# EAGLE design fixture (EAGLE 6.5.0)
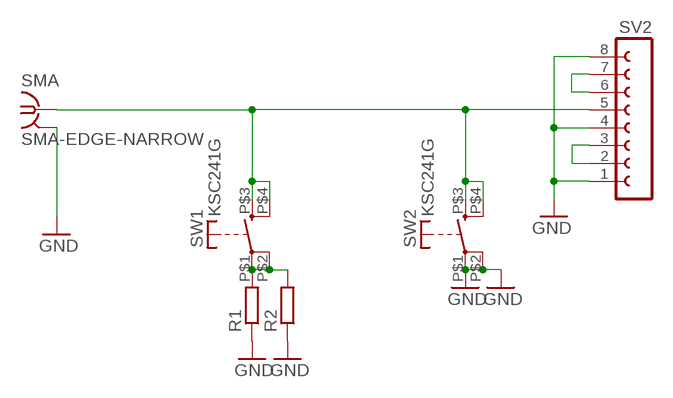
[diagram p0: schematic, sheet 1]

## Parts
R1  R-EU_M0805  [M0805]
R2  R-EU_M0805  [M0805]
SMA  SMA-EDGE-NARROW  [SMD-EDGE-NARROW]
SV2  FE08-1  [FE08]
SW1  KSC241G  [KSC241G]
SW2  KSC241G  [KSC241G]

## Nets
GND: R1.1 R2.1 SMA.G@1 SMA.G@2 SMA.G@3 SMA.G@4 SV2.1 SV2.4 SV2.8 SW2.P$1(P) SW2.P$2(P)
N$2: SV2.2 SV2.3
N$3: R1.2 R2.2 SW1.P$1(P) SW1.P$2(P)
N$4: SV2.6 SV2.7
SIG: SMA.1 SV2.5 SW1.P$3(S) SW1.P$4(S) SW2.P$3(S) SW2.P$4(S)

## Library data of the parts
R1 R2 = resistor:R-EU_: RESISTOR, European symbol
SMA = con-coax:SMA-EDGE-NARROW: Narrow SMA edge connector.
SV2 = con-lsta:FE08-1: FEMALE HEADER; OC_FARNELL: unknown; OC_NEWARK: unknown
SW1 SW2 = switch-misc:KSC241G

## Board
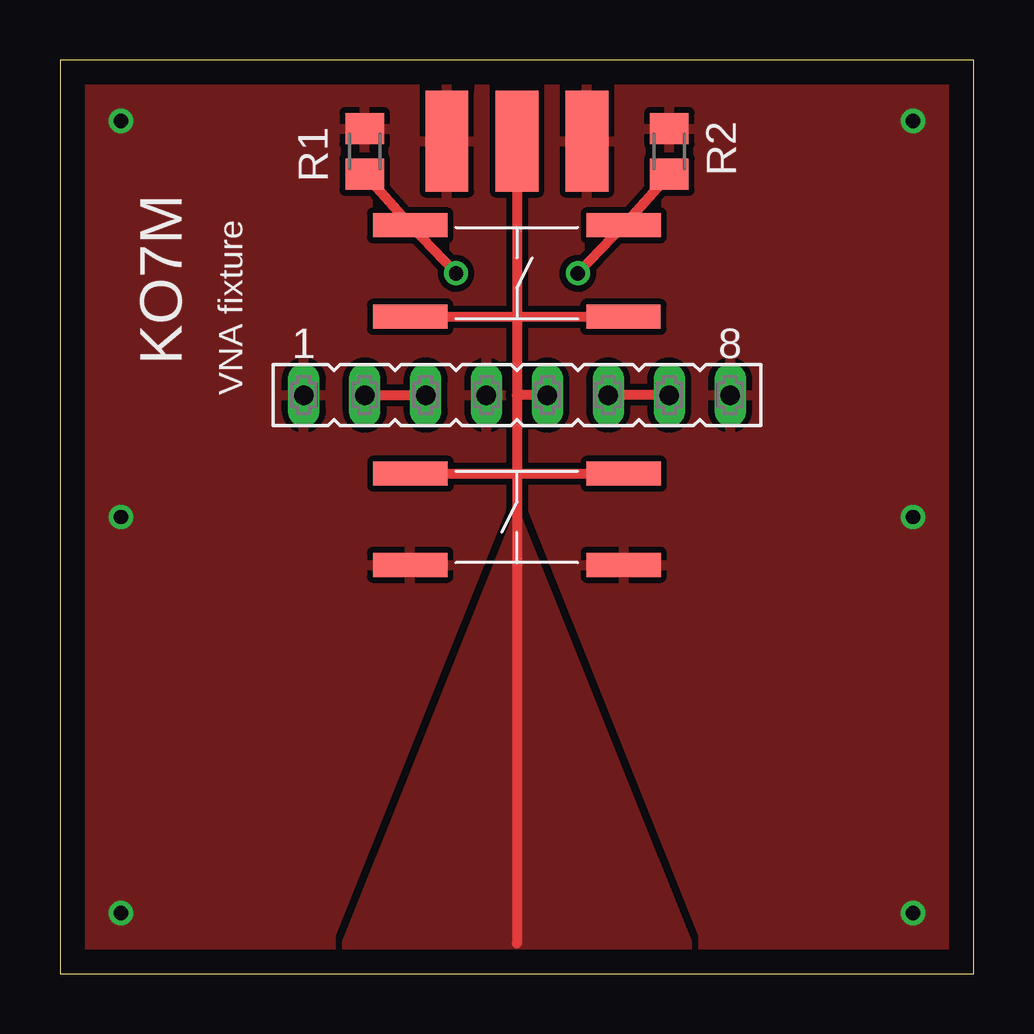
[diagram p1: board, top side]
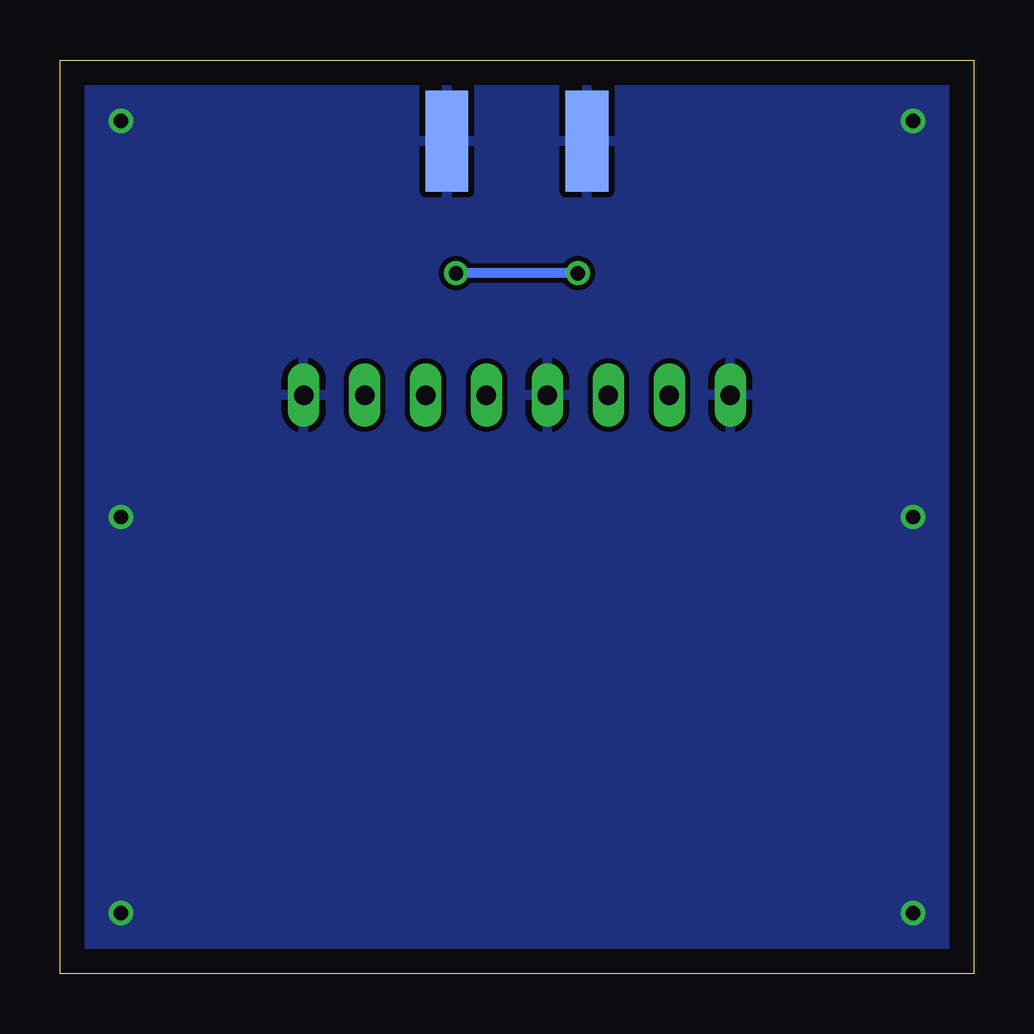
[diagram p2: board, bottom side, seen from below]

Size 38.1 x 38.1 mm. Coordinates in mm from the lower left corner, seen from the top.
Outline: 0,0 38.1,0 38.1,38.1 0,38.1 0,0
Copper layers (1*16): Top 0.035mm / dielectric 1.5mm / Bottom 0.035mm
Design rules "default": minimum track width 10mil, minimum drill 24mil, track to track 8mil, track to pad 8mil, pad to pad 8mil, via to via 8mil, smd to smd 8mil, copper to edge 40mil, drill to drill 8mil, minimum pad ring 10mil, minimum via ring 8mil, stop-mask expansion 4mil, vias tented up to drill 0mil, thermal gap 10mil

### Footprints (pad centres in the part's own frame; a part is rotated, then mirrored left to right if it is on the bottom)
M0805 = smd 1.3 x 1.6: 1 -0.95,0; 2 0.95,0
SMD-EDGE-NARROW = smd 4.191 x 1.778: 1 2.115,0; G@1 2.115,2.921; G@2 2.115,-2.921 | smd 4.191 x 1.778 bottom: G@3 2.115,2.921; G@4 2.115,-2.921
FE08 = drill 0.813 long: 1 -8.89,0; 2 -6.35,0; 3 -3.81,0; 4 -1.27,0; 5 1.27,0; 6 3.81,0; 7 6.35,0; 8 8.89,0
KSC241G = smd 3.1 x 1: P$1 -4.45,2; P$2 4.45,2; P$3 -4.45,-1.81; P$4 4.44,-1.81

### Placement (x,y rotation side)
R1  12.7,34.29 270 top
R2  25.4,34.29 270 top
SMA  19.05,36.83 270 top
SV2  19.05,24.13 0 top
SW1  19.05,29.21 0 top
SW2  19.05,19.05 180 top

### Tracks (layer width: path | path; a pad name or v marks a point on that pad's centre or on a via)
GND  (via drill 0.6)
  other vias: 2.54,35.56 35.56,35.56 35.56,2.54 2.54,2.54 2.54,19.05 35.56,19.05
  pour Top (isolate 0.254, rank 6): 0,38.1 38.1,38.1 38.1,0 0,0
  pour Bottom: 0,38.1 38.1,38.1 38.1,0 0,0
N$2
  Top 0.406: SV2.2 SV2.3
N$3  (via drill 0.6)
  Top 0.406: R2.2 SW1.P$2 v21.59,29.21 | R1.2 SW1.P$1 v16.51,29.21
  Bottom 0.406: v16.51,29.21 v21.59,29.21
N$4
  Top 0.406: SV2.7 SV2.6
SIG
  Top 0.406: SMA.1 19.05,27.4 | 19.05,20.86 19.05,1.27 | SW1.P$3 19.05,27.4 | 19.05,27.4 SW1.P$4 | SW2.P$4 19.05,20.86 | 19.05,20.86 SW2.P$3 | 19.05,27.4 19.05,24.13 | 19.05,24.13 19.05,20.86 | SV2.5 19.05,24.13
  pour Top (isolate 0.254): 19.05,19.05 11.43,0 26.67,0

### Text on the board
tNames: KO7M | VNA fixture